# EAGLE schematic Suntracker_v1_2 (EAGLE 9.6.1)
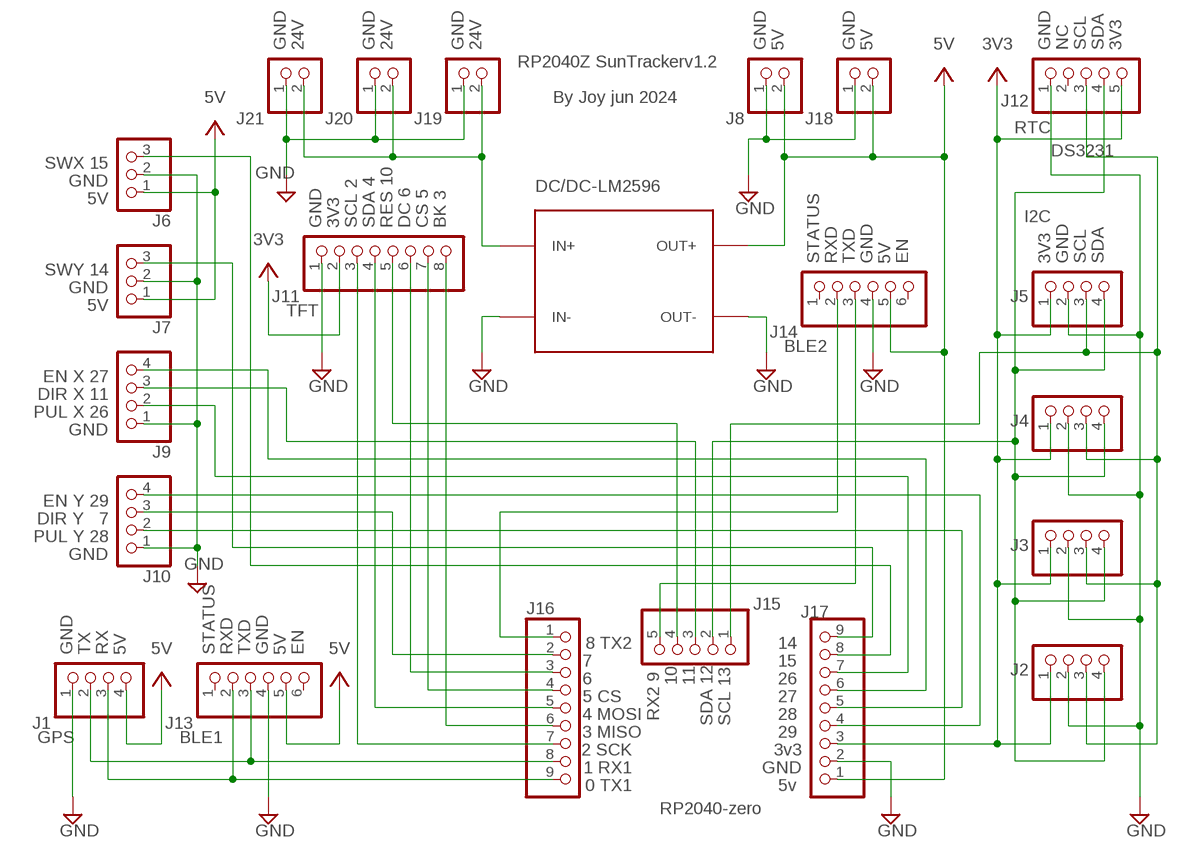
[diagram p0: schematic, sheet 1]

## Parts
J1  PINHD-1X04_2.54  [1X04]
J2  PINHD-1X04_2.54  [1X04]
J3  PINHD-1X04_2.54  [1X04]
J4  PINHD-1X04_2.54  [1X04]
J5  PINHD-1X04_2.54  [1X04]
J6  PINHD-1X3  [1X03]
J7  PINHD-1X3  [1X03]
J8  PINHD-1X2  [1X02]
J9  PINHD-1X04_2.54  [1X04]
J10  PINHD-1X04_2.54  [1X04]
J11  PINHD-1X8  [1X08]
J12  PINHD-1X05_2.54  [1X05]
J13  PINHD-1X06_2.54  [1X06]
J14  PINHD-1X06_2.54  [1X06]
J15  PINHD-1X05_2.54  [1X05]
J16  PINHD-1X9/90  [1X09/90]
J17  PINHD-1X9/90  [1X09/90]
J18  PINHD-1X2  [1X02]
J19  PINHD-1X2  [1X02]
J20  PINHD-1X2  [1X02]
J21  PINHD-1X2  [1X02]
U1  DC/DC-LM2596  DC-DC-STEP-DOWN-LM2596  [DC-DC-STEP-DOWN-LM2596]

## Nets
GND: J1.1 J2.2 J3.2 J4.2 J5.2 J6.2 J7.2 J8.1 J9.1 J10.1 J11.1 J12.1 J13.4 J14.4 J17.2 J18.1 J19.1 J20.1 J21.1 U1.IN- U1.OUT-
N$1: J14.2 J16.1
N$2: J11.5 J15.4
N$3: J1.3 J13.2 J16.9
N$4: J2.3 J3.3 J4.3 J5.3 J12.3 J15.1
N$5: J1.2 J13.3 J16.8
N$6: J14.3 J15.5
N$7: J11.3 J16.7
N$8: J11.8 J16.6
N$9: J11.4 J16.5
N$10: J11.7 J16.4
N$11: J19.2 J20.2 J21.2 U1.IN+
N$12: J2.4 J3.4 J4.4 J5.4 J12.4 J15.2
N$13: J11.6 J16.3
N$15: J9.2 J17.7
N$16: J10.4 J17.4
N$17: J10.2 J17.5
N$18: J10.3 J16.2
N$19: J9.3 J15.3
N$20: J9.4 J17.6
N$21: J7.3 J17.9
N$22: J6.3 J17.8
V+: J1.4 J2.1 J3.1 J4.1 J5.1 J6.1 J7.1 J8.2 J11.2 J12.5 J13.5 J14.5 J17.1 J17.3 J18.2 U1.OUT+
Unconnected: J12.2 J13.1 J13.6 J14.1 J14.6

## Notes on the sheet
- GND | 24V | GND | 24V | GND | 24V | GND | 5V | GND | 5V | GND | NC | SCL | SDA | 3V3
- RP2040Z SunTrackerv1.2
- By Joy jun 2024
- RTC
- SWX 15 | DS3231
- GND
- 5V
- I2C
- GND | 3V3 | SCL 2 | SDA 4 | RES 10 | DC 6 | CS 5 | BK 3
- SWY 14 | STATUS | RXD | TXD | GND | 5V | EN | 3V3 | GND | SCL | SDA
- GND
- 5V
- TFT
- BLE2
- EN X 27
- DIR X 11
- PUL X 26
- GND
- EN Y 29
- DIR Y   7
- PUL Y 28
- GND
- 8 TX2 | 14
- GND | TX | RX | 5V | STATUS | RXD | TXD | GND | 5V | EN | 7 | 15
- 6 | 26
- 5 CS | 10 | 11 | 27
- 4 MOSI | 28
- 3 MISO | RX2 9 | SDA 12 | SCL 13 | 29
- GPS | BLE1 | 2 SCK | 3v3
- 1 RX1 | GND
- 0 TX1 | 5v
- RP2040-zero

## Library data of the parts
J1-J5 J9 J10 = pinhead-2:PINHD-1X04: PIN HEADER
J6 J7 = Connector:PINHD-1X3: PIN HEADER; CATEGORY: Headers; DESCRIPTION: Header-Straight-3 Position; PACKAGE_TYPE: THT; PITCH: 0.100" (2.54mm); SUBCATEGORY: Headers-Male Pins; TYPE: Board to Board or Cable-Unshrouded-Through Hole-Straight
J8 J18-J21 = Connector:PINHD-1X2: PIN HEADER; CATEGORY: Headers; DESCRIPTION: Header-Straight-2 Position; PACKAGE_TYPE: THT; PITCH: 0.100" (2.54mm); SUBCATEGORY: Headers-Male Pins; TYPE: Board to Board or Cable-Unshrouded-Through Hole-Straight
J11 = Connector:PINHD-1X8: PIN HEADER; CATEGORY: Headers; DESCRIPTION: Header-Straight-8 Position; PACKAGE_TYPE: THT; PITCH: 0.100" (2.54mm); SUBCATEGORY: Headers-Male Pins; TYPE: Board to Board or Cable-Unshrouded-Through Hole-Straight
J12 J15 = pinhead-2:PINHD-1X05: PIN HEADER
J13 J14 = pinhead-2:PINHD-1X06: PIN HEADER
J16 J17 = Connector:PINHD-1X9: PIN HEADER; CATEGORY: Headers; DESCRIPTION: Header-Right Angle-9 Position; PACKAGE_TYPE: THT; PITCH: 0.100" (2.54mm); SUBCATEGORY: Headers-Male Pins; TYPE: Board to Board or Cable-Unshrouded-Through Hole-Right Angle
U1 = diy-modules:DC-DC-STEP-DOWN-LM2596: DC/DC Step-Down Regulator based on LM2596-ADJ chip LM2596 datasheet available here: http://www.ti.com/lit/ds/symlink/lm2596.pdf Click here to find device on ebay.com <http://www.ebay.com/sch/lm2596+power+regulator>